# EAGLE schematic lumped-transmission-line (EAGLE 7.7.0)
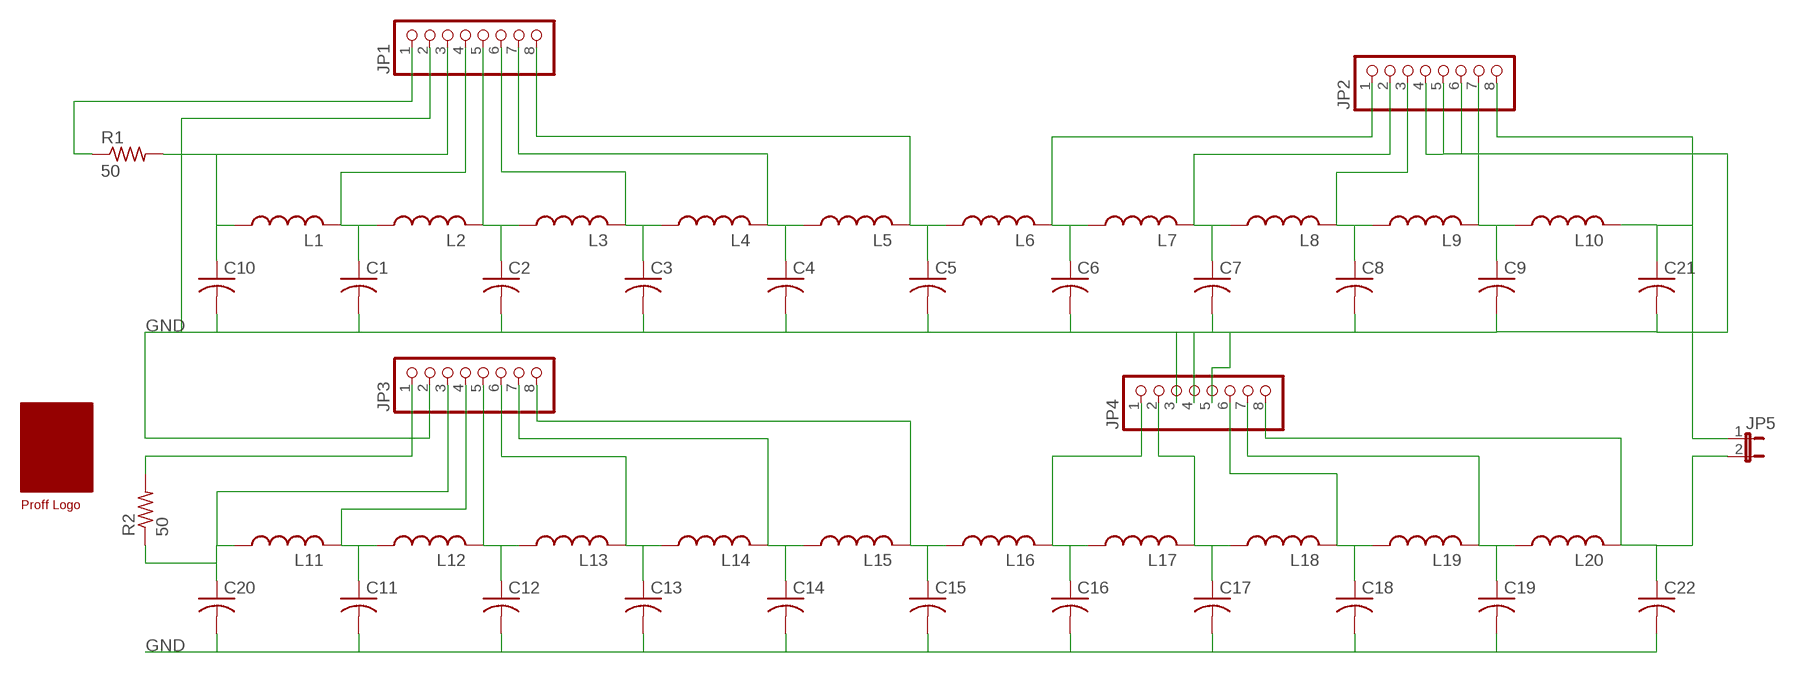
[diagram p0: schematic, sheet 1]

## Parts
C1  C-USC1206  [C1206]
C2  C-USC1206  [C1206]
C3  C-USC1206  [C1206]
C4  C-USC1206  [C1206]
C5  C-USC1206  [C1206]
C6  C-USC1206  [C1206]
C7  C-USC1206  [C1206]
C8  C-USC1206  [C1206]
C9  C-USC1206  [C1206]
C10  C-USC1206  [C1206]
C11  C-USC1206  [C1206]
C12  C-USC1206  [C1206]
C13  C-USC1206  [C1206]
C14  C-USC1206  [C1206]
C15  C-USC1206  [C1206]
C16  C-USC1206  [C1206]
C17  C-USC1206  [C1206]
C18  C-USC1206  [C1206]
C19  C-USC1206  [C1206]
C20  C-USC1206  [C1206]
C21  C-USC1206  [C1206]
C22  C-USC1206  [C1206]
JP1  PINHD-1X8  [1X08]
JP2  PINHD-1X8  [1X08]
JP3  PINHD-1X8  [1X08]
JP4  PINHD-1X8  [1X08]
JP5  JP1E  [JP1]
L1  L-USL5650M  [L5650M]
L2  L-USL5650M  [L5650M]
L3  L-USL5650M  [L5650M]
L4  L-USL5650M  [L5650M]
L5  L-USL5650M  [L5650M]
L6  L-USL5650M  [L5650M]
L7  L-USL5650M  [L5650M]
L8  L-USL5650M  [L5650M]
L9  L-USL5650M  [L5650M]
L10  L-USL5650M  [L5650M]
L11  L-USL5650M  [L5650M]
L12  L-USL5650M  [L5650M]
L13  L-USL5650M  [L5650M]
L14  L-USL5650M  [L5650M]
L15  L-USL5650M  [L5650M]
L16  L-USL5650M  [L5650M]
L17  L-USL5650M  [L5650M]
L18  L-USL5650M  [L5650M]
L19  L-USL5650M  [L5650M]
L20  L-USL5650M  [L5650M]
R1  50  R-US_0204/7  [0204/7]
R2  50  R-US_0204/7  [0204/7]
U$1  PROFF  [PROFF]

## Nets
GND: C1.2 C2.2 C3.2 C4.2 C5.2 C6.2 C7.2 C8.2 C9.2 C10.2 C11.2 C12.2 C13.2 C14.2 C15.2 C16.2 C17.2 C18.2 C19.2 C20.2 C21.2 C22.2 JP1.2 JP2.4 JP2.5 JP2.6 JP3.2 JP4.3 JP4.4 JP4.5
N$1: C3.1 JP1.6 L3.2 L4.1
N$4: C21.1 JP2.8 JP5.1 L10.2
N$11: C22.1 JP4.8 JP5.2 L20.2
N$14: C9.1 JP2.7 L9.2 L10.1
N$20: C19.1 JP4.7 L19.2 L20.1
N$22: JP1.1 R1.1
N$24: C15.1 JP3.8 L15.2 L16.1
N$26: C17.1 JP4.2 L17.2 L18.1
N$27: C18.1 JP4.6 L18.2 L19.1
N$29: JP3.1 R2.2
N$31: C13.1 JP3.6 L13.2 L14.1
N$33: C11.1 JP3.4 L11.2 L12.1
N$35: C6.1 JP2.1 L6.2 L7.1
N$37: C4.1 JP1.7 L4.2 L5.1
N$39: C2.1 JP1.5 L2.2 L3.1
N$41: C10.1 JP1.3 L1.1 R1.2
N$43: C8.1 JP2.3 L8.2 L9.1
N$45: C20.1 JP3.3 L11.1 R2.1
N$46: C1.1 JP1.4 L1.2 L2.1
N$49: C12.1 JP3.5 L12.2 L13.1
N$53: C14.1 JP3.7 L14.2 L15.1
N$54: C5.1 JP1.8 L5.2 L6.1
N$57: C16.1 JP4.1 L16.2 L17.1
N$58: C7.1 JP2.2 L7.2 L8.1

## Library data of the parts
C1-C22 = resistor:C-US: CAPACITOR, American symbol
JP1-JP4 = pinhead:PINHD-1X8: PIN HEADER
JP5 = jumper:JP1E: JUMPER
L1-L20 = resistor:L-US: INDUCTOR, American symbol
R1 R2 = resistor:R-US_: RESISTOR, American symbol
U$1 = logo:PROFF